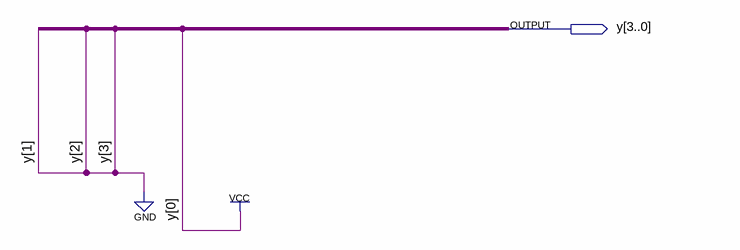
[diagram p0: schematic sheet]
// Quartus schematic I_inicial.bdf as structural Verilog: 0 symbols, 1 pins
module I_inicial (
  output [3:0] y
);


  assign y = 4'b0001;
endmodule
